# Altium schematic sheet Sensor.SchDoc
size A4; SheetNumber: 3; SheetTotal: 3
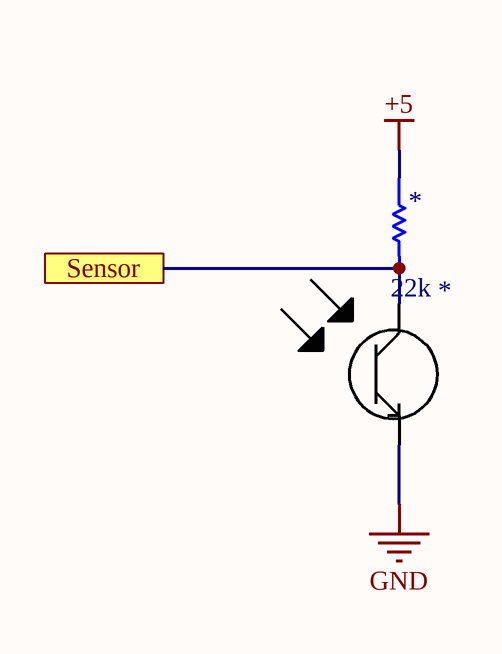
[diagram p0: Sensor.SchDoc]

## Parts
(Parts that share a designator on the sheet are numbered #1, #2 ... from top to bottom, then left to right.)
*#1  value 22k  [0402 Res]  (hidden comment: Resistor 0402 template)
*#2  APS3227SP1C-P22  [APS3227SP1C-P22]  (value not drawn)

## Ports
Sensor

## Nets
+5: *#1.1
GND: *#2.2(E)
Sensor: *#1.2 *#2.1(C) ; port Sensor

## Library data of the parts
*#2 = APS3227SP1C-P22: Phototransistor